# Altium schematic sheet ST_Board.SchDoc
size A4; SheetNumber: 1; SheetTotal: 1
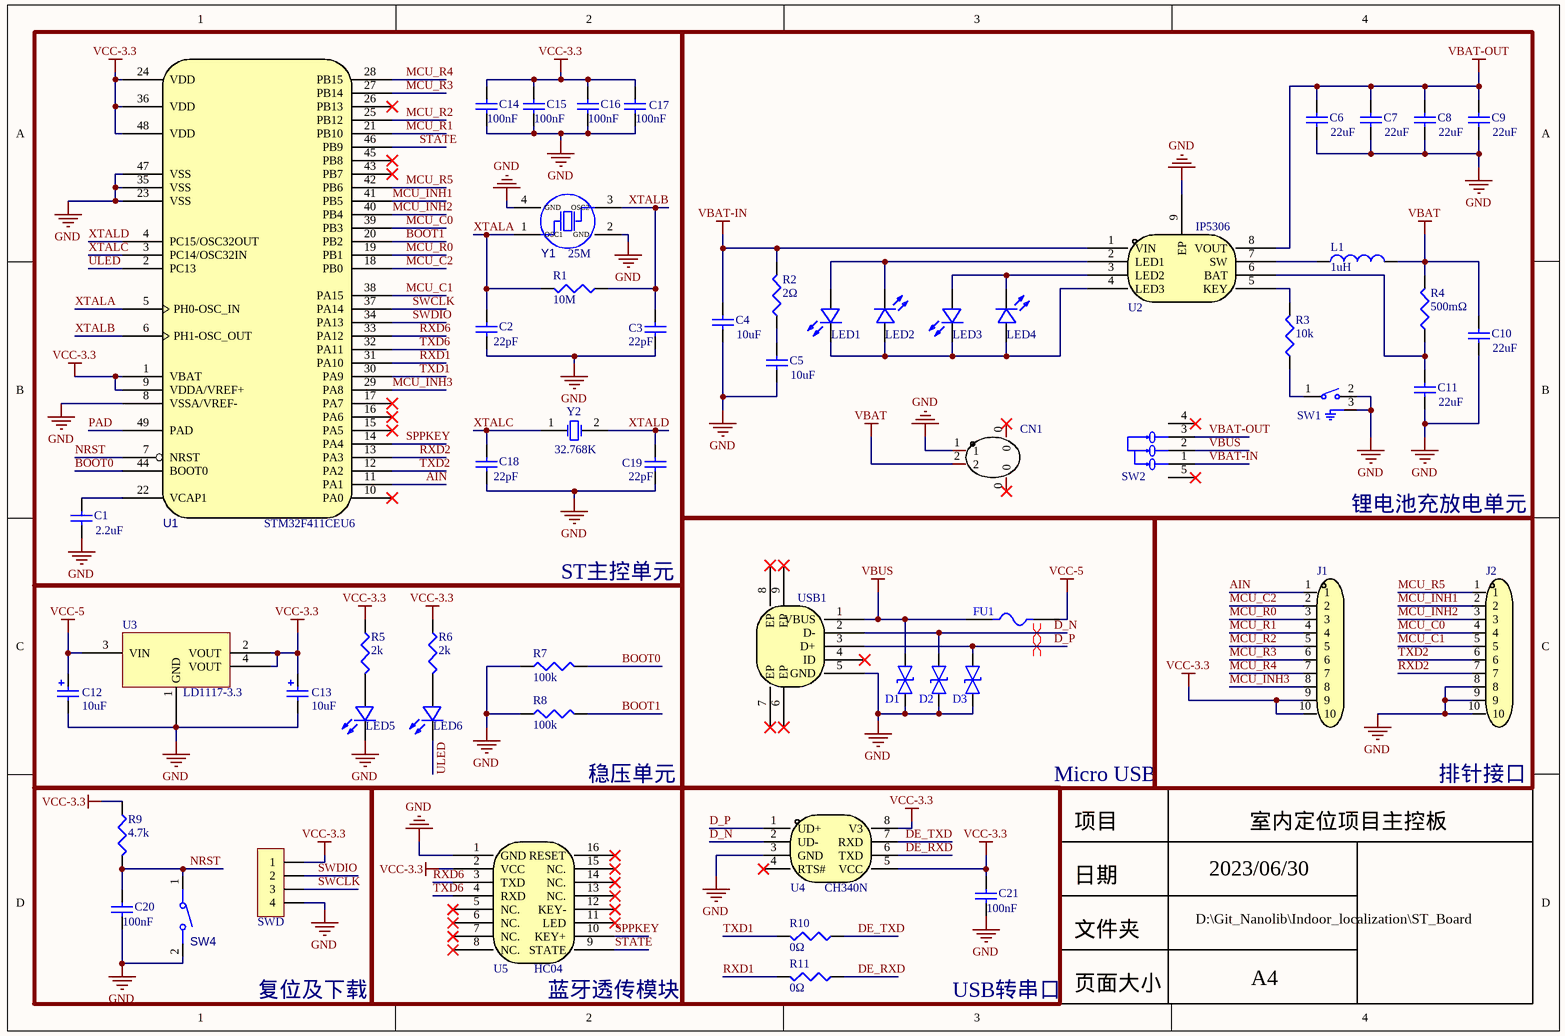
[diagram p0: ST_Board.SchDoc]

## Parts
C1  value 2.2uF  [C0603]  (hidden comment: Cap)
C2  value 22pF  [C0603]  (hidden comment: Cap)
C3  value 22pF  [C0603]  (hidden comment: Cap)
C4  value 10uF  [C0603]  (hidden comment: Cap)
C5  value 10uF  [C0603]  (hidden comment: Cap)
C6  value 22uF  [C1206]  (hidden comment: Cap)
C7  value 22uF  [C1206]  (hidden comment: Cap)
C8  value 22uF  [C1206]  (hidden comment: Cap)
C9  value 22uF  [C1206]  (hidden comment: Cap)
C10  value 22uF  [C1206]  (hidden comment: Cap)
C11  value 22uF  [C1206]  (hidden comment: Cap)
C12  value 10uF  [CAP-SMD_L3.2-W1.6-RD-C7171]  (hidden comment: TAJA106K016RNJ)
C13  value 10uF  [CAP-SMD_L3.2-W1.6-RD-C7171]  (hidden comment: TAJA106K016RNJ)
C14  value 100nF  [C0603]  (hidden comment: Cap)
C15  value 100nF  [C0603]  (hidden comment: Cap)
C16  value 100nF  [C0603]  (hidden comment: Cap)
C17  value 100nF  [C0603]  (hidden comment: Cap)
C18  value 22pF  [C0603]  (hidden comment: Cap)
C19  value 22pF  [C0603]  (hidden comment: Cap)
C20  value 100nF  [C0603]  (hidden comment: Cap)
C21  value 100nF  [C0603]  (hidden comment: Cap)
CN1  1.0T-2P卧贴  [CONN-SMD_1.0T-2P]  (value not drawn)
D1  LESD5D5.0CT1G  [SOD-523_L1.2-W0.8-LS1.6-BI]  (value not drawn)
D2  LESD5D5.0CT1G  [SOD-523_L1.2-W0.8-LS1.6-BI]  (value not drawn)
D3  LESD5D5.0CT1G  [SOD-523_L1.2-W0.8-LS1.6-BI]  (value not drawn)
FU1  FUSE 1A  [F0805]  (value not drawn)
J1  Header 10X1  [HDR-TH_10P-P2.54-V-M]  (value not drawn)
J2  Header 10X1  [HDR-TH_10P-P2.54-V-M]  (value not drawn)
L1  value 1uH  [IND-SMD_L6.5-W6.5_IHLP-2525]  (hidden comment: Inductor)
LED1  NCD0603G2  [LED0603-RD]  (value not drawn)
LED2  NCD0603G2  [LED0603-RD]  (value not drawn)
LED3  NCD0603G2  [LED0603-RD]  (value not drawn)
LED4  NCD0603G2  [LED0603-RD]  (value not drawn)
LED5  NCD0603G2  [LED0603-RD]  (value not drawn)
LED6  NCD0603G2  [LED0603-RD]  (value not drawn)
R1  10M  [R0603]
R2  2Ω  [R0603]
R3  10k  [R0603]
R4  500mΩ  [R0603]
R5  2k  [R0603]
R6  2k  [R0603]
R7  100k  [R0603]
R8  100k  [R0603]
R9  4.7k  [R0603]
R10  0Ω  [R0603]
R11  0Ω  [R0603]
SW1  GT-TCB73B-H048-L1  [SW-TH_G-SWITCH_GT-TCB73B-H048-L1]  (value not drawn)
SW2  SK12D07VG3  [SW-TH_SK12D07VG3]  (value not drawn)
SW4  TS-1088-AR02016  [SW-SMD_L3.9-W3.0-P4.45]  (value not drawn)
SWD  SWD  [HDR-TH_4P-P2.54-V-F]  (value not drawn)
U1  STM32F411CEU6  [UFQFPN-48_L7.0-W7.0-P0.50-BL-EP]
U2  IP5306  [ESOP-8_L4.9-W3.9-P1.27-LS6.0-BL-EP]
U3  LD1117-3.3  [SOT-223-3_L6.5-W3.4-P2.30-LS7.0-BR]
U4  CH340N  [SOP-8_L4.9-W3.9-P1.27-LS6.0-BL]
U5  HC04  [HC-04]
USB1  U-F-M5DD-W-2  [MICRO-USB-SMD_MICRO-USB-A17]  (value not drawn)
Y1  25M  [OSC-SMD_4P-L3.2-W2.5-BL]
Y2  32.768K  [FC-135R_L3.2-W1.5]

## Blocks framed on the sheet
ST主控单元: C1-C3 C14-C19 R1 U1 Y1 Y2
锂电池充放电单元: C4-C11 CN1 L1 LED1-LED4 R2-R4 SW1 SW2 U2
Micro USB: D1-D3 FU1 USB1
复位及下载: C20 R9 SW4 SWD

## Nets
GND: C1.1 C2.1 C3.1 C4.1 C5.1 C6.1 C7.1 C8.1 C9.1 C10.1 C11.1 C12.2 C13.2 C14.1 C15.1 C16.1 C17.1 C18.1 C19.1 C20.1 C21.1 CN1.1 D1.1 D2.1 D3.1 J2.8 J2.9 J2.10 LED5.1(K) R7.1 R8.1 SW1.2 SW1.3 SW4.2 SWD.4 U1.8(VSSA/VREF-) U1.23(VSS) U1.35(VSS) U1.47(VSS) U2.9(EP) U3.1(GND) U4.3(GND) U5.1(GND) USB1.5(GND) Y1.2(GND) Y1.4(GND)
VBAT: C10.2 CN1.2 L1.2 R4.2
VBAT-IN: C4.2 R2.2 SW2.1 U2.1(VIN)
VBAT-OUT: C6.2 C7.2 C8.2 C9.2 SW2.3 U2.8(VOUT)
VBUS: D1.2 FU1.1 SW2.2 USB1.1(VBUS)
VCC-3.3: C13.1 C14.2 C15.2 C16.2 C17.2 C21.2 J1.9 J1.10 R5.1 R6.1 R9.1 SWD.1 U1.1(VBAT) U1.9(VDDA/VREF+) U1.24(VDD) U1.36(VDD) U1.48(VDD) U3.2(VOUT) U3.4(VOUT) U4.5(VCC) U4.8(V3) U5.2(VCC)
VCC-5: C12.1 FU1.2 U3.3(VIN)
AIN: J1.1 U1.11(PA1)
BOOT0: R7.2 U1.44(BOOT0)
BOOT1: R8.2 U1.20(PB2)
D_N: D2.2 U4.2(UD-) USB1.2(D-)
D_P: D3.2 U4.1(UD+) USB1.3(D+)
DE_RXD: R11.1 U4.6(TXD)
DE_TXD: R10.1 U4.7(RXD)
MCU_C0: J2.4 U1.39(PB3)
MCU_C1: J2.5 U1.38(PA15)
MCU_C2: J1.2 U1.18(PB0)
MCU_INH1: J2.2 U1.41(PB5)
MCU_INH2: J2.3 U1.40(PB4)
MCU_INH3: J1.8 U1.29(PA8)
MCU_R0: J1.3 U1.19(PB1)
MCU_R1: J1.4 U1.21(PB10)
MCU_R2: J1.5 U1.25(PB12)
MCU_R3: J1.6 U1.27(PB14)
MCU_R4: J1.7 U1.28(PB15)
MCU_R5: J2.1 U1.42(PB6)
NRST: C20.2 R9.2 SW4.1 U1.7(NRST)
PAD: U1.49(PAD)
RXD1: R11.2 U1.31(PA10)
RXD2: J2.7 U1.13(PA3)
RXD6: U1.33(PA12) U5.3(TXD)
SPPKEY: U1.14(PA4) U5.10(KEY+)
STATE: U1.46(PB9) U5.9(STATE)
SWCLK: SWD.3 U1.37(PA14)
SWDIO: SWD.2 U1.34(PA13)
TXD1: R10.2 U1.30(PA9)
TXD2: J2.6 U1.12(PA2)
TXD6: U1.32(PA11) U5.4(RXD)
ULED: LED6.1(K) U1.2(PC13)
XTALA: C2.2 R1.2 U1.5(PH0-OSC_IN) Y1.1(OSC1)
XTALB: C3.2 R1.1 U1.6(PH1-OSC_OUT) Y1.3(OSC2)
XTALC: C18.2 U1.3(PC14/OSC32IN) Y2.1(OSC1)
XTALD: C19.2 U1.4(PC15/OSC32OUT) Y2.2(OSC2)
NetC1_2: C1.2 U1.22(VCAP1)
NetC5_2: C5.2 R2.1
NetC11_2: C11.2 R4.1 U2.6(BAT)
NetL1_1: L1.1 U2.7(SW)
NetLED1_1: LED1.1(K) LED2.2(A) LED3.1(K) LED4.2(A) U2.4(LED3)
NetLED1_2: LED1.2(A) LED2.1(K) U2.2(LED1)
NetLED3_2: LED3.2(A) LED4.1(K) U2.3(LED2)
NetLED5_2: LED5.2(A) R5.2
NetLED6_2: LED6.2(A) R6.2
NetR3_1: R3.1 SW1.1
NetR3_2: R3.2 U2.5(KEY)

Not connected (* = marked no-connect by the designer): CN1 0*; SW2 4* 5*; U1 10(PA0)* 15(PA5)* 16(PA6)* 17(PA7)* 26(PB13)* 43(PB7)* 45(PB8)*; U4 4(RTS#)*; U5 5(NC.)* 6(NC.)* 7(NC.)* 8(NC.)* 11(LED)* 12(KEY-)* 13(NC.)* 14(NC.)* 15(NC.)* 16(RESET)*; USB1 4(ID)* 6(EP)* 7(EP)* 8(EP)* 9(EP)*

## Layout directives
differential pair: D_N, D_P

## Notes on the sheet
- 稳压单元
- (near J2) 排针接口
- 项目
- 室内定位项目主控板
- 日期
- 2023/06/30
- 文件夹
- D:\Git_Nanolib\Indoor_localization\ST_Board
- A4
- (near U5) 蓝牙透传模块
- USB转串口
- 页面大小

## Library data of the parts
C1-C11 C14-C21 = Cap: Capacitor; Published: 8-Jun-2000; LatestRevisionDate: 17-Jul-2002; LatestRevisionNote: Re-released for DXP Platform.; PackageReference: RAD-0.3; Publisher: Altium Limited; PackageDescription: Radial Cap, Thru-Hole; 2 Leads; 0.3 in Pin Spacing
C12 C13 = Cap-TAJA: 贴片钽电容; Manufacturer: Kyocera AVX; Add into BOM: yes; Tolerance: ±10%; Rated Voltage: 16V; Equivalent Series Resistance(ESR): 3Ω@100kHz; Name: 10uF; Symbol: TAJA106K016RNJ; Device: TAJA106K016RNJ; LCSC Part Name: 10uF ±10% 16V; Supplier Part: C7171; Manufacturer Part: TAJA106K016RNJ; Supplier Footprint: CASE-A-3216; JLCPCB Part Class: Basic Part; Datasheet: https://atta.szlcsc.com/upload/public/pdf/source/20160107/1457707748093.pdf; Supplier: LCSC; Convert to PCB: yes; Operating Temperature: -55℃~+125℃
CN1 = 1.0T-2P卧贴: 锂电池接口; Manufacturer: BOOMELE(博穆精密); Symbol: 1.0T-2P_C145954; Add into BOM: yes; Reference Series: SH; Pitch: 1mm; Pins Structure: 1x2P; Number of PINs Per Row: 2; Name: 1.0T-2P卧贴; Device: 1.0T-2P卧贴; LCSC Part Name: SH 1mm 1x2P 卧贴; Supplier Part: C145954; Manufacturer Part: 1.0T-2P卧贴; Supplier Footprint: SMD,P=1mm; JLCPCB Part Class: Extended Part; Datasheet: https://atta.szlcsc.com/upload/public/pdf/source/20171115/C145954_15107293403501120439.pdf; Supplier: LCSC; Convert to PCB: yes; Number of Rows: 1; Row Spacing: -; Mounting Style: -; Contact Material: 磷铜
D1-D3 = LESD5D5.0CT1G: 静电放电(ESD)保护器件; Designer: U?; Symbol: LESD5D5.0CT1G; Device: LESD5D5.0CT1G
FU1 = FU: 贴片保险丝; Manufacturer: RUILON(瑞隆源); Name: SMD0805P075TF; Device: SMD0805P075TF_C20979; Add into BOM: yes; Operating Voltage (Max): 6V; Current Rating (Max): 40A; Hold Current: 750mA; Trip Current: 1.5A; Symbol: SMD0805P075TF; LCSC Part Name: 6V 750mA 0805自恢复; Supplier Part: C20979; Manufacturer Part: SMD0805P075TF; Supplier Footprint: 0805; JLCPCB Part Class: Extended Part; Datasheet: https://atta.szlcsc.com/upload/public/pdf/source/20140222/1457706788789.pdf; Supplier: LCSC; Convert to PCB: yes
J1 J2 = Header 10X1: 10P*1接插件; Symbol: MF254V-11-10-1000-H70; Designer: U?; Device: MF254V-11-10-1000-H70
L1 = Inductor: Code_IEC: 1005; Published: 8-Jun-2000; LatestRevisionDate: 29-May-2009; LatestRevisionNote: IPC-7351 Footprint Added.; PackageReference: 0402-A; Publisher: Altium Limited; PackageDescription: Chip Inductor; Code_JEITA: 0402
LED1-LED4 = NCD0603G2: Manufacturer: 国星光电; Symbol: FC-1608UGK-520D; Add into BOM: yes; Emitted Color: 翠绿; Name: NCD0603G2; Device: NCD0603G2; LCSC Part Name: 翠绿; Supplier Part: C87326; Manufacturer Part: NCD0603G2; Supplier Footprint: 0603; JLCPCB Part Class: Extended Part; Datasheet: https://atta.szlcsc.com/upload/public/pdf/source/20200820/C87326_434E337B13CFAB9A1423E0838CFDDDAC.pdf; Supplier: LCSC; Convert to PCB: yes
LED5 LED6 = NCD0603G2: LED; Manufacturer: 国星光电; Symbol: FC-1608UGK-520D; Add into BOM: yes; Emitted Color: 翠绿; Name: NCD0603G2; Device: NCD0603G2; LCSC Part Name: 翠绿; Supplier Part: C87326; Manufacturer Part: NCD0603G2; Supplier Footprint: 0603; JLCPCB Part Class: Extended Part; Datasheet: https://atta.szlcsc.com/upload/public/pdf/source/20200820/C87326_434E337B13CFAB9A1423E0838CFDDDAC.pdf; Supplier: LCSC; Convert to PCB: yes
R1-R11 = Res3: Resistor; Published: 8-Jun-2000; LatestRevisionDate: 29-May-2009; LatestRevisionNote: IPC-7351 Footprint Added.; PackageReference: J1-0603; Publisher: Altium Limited; PackageDescription: Chip Resistor
SW1 = GT-TCB73B-H048-L1: Manufacturer: G-Switch(品赞); Add into BOM: yes; Contact Current: 50mA; Voltage Rating (DC): 12V; Insulation Resistance: 100MΩ; Circuit: 单刀单掷; Actuator Style: 圆形按钮; Actuator/Cap Color: 黑色; With Lamp: 无; Operating Force: 250gf@±30gf; Mechanical Life: 10万次; Pin Style: PC引脚; Switch Length: 4.5mm; Switch Height: 4.8mm; Strike Gundam: 否; Name: GT-TCB73B-H048-L1; Symbol: GT-TCB73B-H048-L1; Device: GT-TCB73B-H048-L1; LCSC Part Name: 4.5*4.5*4.8mm 卧插 轻触开关; Supplier Part: C2890354; Manufacturer Part: GT-TCB73B-H048-L1; Supplier Footprint: 插件; JLCPCB Part Class: Extended Part; Datasheet: https://atta.szlcsc.com/upload/public/pdf/source/20211129/A9DBC36F7854845B7C58D6A3B2089FE3.pdf; Supplier: LCSC; Convert to PCB: yes; Mounting Style: 卧插; Operating Temperature: -30℃~+85℃; Switch Width: 4.5mm
SW2 = SK12D07VG3: Manufacturer: SHOU HAN(首韩); Symbol: SK12D07VG3_C431547; Add into BOM: yes; Name: SK12D07VG3; Device: SK12D07VG3; LCSC Part Name: 两档位卧式拨动开关,柄长3MM; Supplier Part: C431547; Manufacturer Part: SK12D07VG3; Supplier Footprint: 插件; JLCPCB Part Class: Extended Part; Datasheet: https://atta.szlcsc.com/upload/public/pdf/source/20190925/C431547_01B93C6F3FA5C09E15F8CCBF4E6DB91A.pdf; Supplier: LCSC; Convert to PCB: yes
SW4 = TS-1088-AR02016: Manufacturer: XUNPU(讯普); Add into BOM: yes; Contact Current: 50mA; Voltage Rating (DC): 12V; Insulation Resistance: 100MΩ; Circuit: 单刀单掷; Actuator Style: 圆形按钮; Actuator/Cap Color: 黑色; Operating Force: 160gf@±50gf; Mechanical Life: 10万次; Pin Style: SMD接片; Switch Length: 4mm; Switch Width: 3mm; Switch Height: 2mm; Strike Gundam: 否; Name: TS-1088-AR02016; Symbol: TS-1088-AR02016; Device: TS-1088-AR02016; LCSC Part Name: 4*3*2mm 立贴 轻触开关; Supplier Part: C720477; Manufacturer Part: TS-1088-AR02016; Supplier Footprint: SMD; JLCPCB Part Class: Extended Part; Datasheet: https://atta.szlcsc.com/upload/public/pdf/source/20200810/C720475_60D09DD6C54279ADDB2DC25100F1CC11.pdf; Supplier: LCSC; Convert to PCB: yes; Mounting Style: 立贴; Operating Temperature: -30℃~+80℃
SWD = Header 4: 4P接插件; 版权归属: 源创客; BOM名称: 4P接插件; 学习资源: www.ooocke.com
U1 = STM32F411CEU6: Designer: U?; Symbol: STM32F411CEU6; Device: STM32F411CEU6
U2 = IP5306: Manufacturer: INJOINIC(英集芯); Add into BOM: yes; Name: IP5306; Symbol: IP5306; Device: IP5306; LCSC Part Name: IP5306; Supplier Part: C181692; Manufacturer Part: IP5306; Supplier Footprint: ESOP-8; JLCPCB Part Class: Extended Part; Datasheet: https://atta.szlcsc.com/upload/public/pdf/source/20180920/C181692_842C9BF636DF123BB66E91FC1AD6F13F.pdf; Supplier: LCSC; Convert to PCB: yes
U3 = LD1117-3.3: 低压差线性稳压器3.3V
U4 = CH340N: Symbol: CH340N_C2977777; Designer: U?; Device: CH340N_C2977777
U5 = HC04: SPP2.1+BLE5.0
USB1 = U-F-M5DD-W-2: Manufacturer: 韩国韩荣; Add into BOM: yes; Connector Type: Micro-B; Gender: 母座; Number of Contacts: 5; Number of Ports: 1; Name: U-F-M5DD-W-2; Symbol: U-F-M5DD-W-2; Device: U-F-M5DD-W-2; LCSC Part Name: U-F-M5DD-W-2; Supplier Part: C145793; Manufacturer Part: U-F-M5DD-W-2; Supplier Footprint: -; JLCPCB Part Class: Extended Part; Datasheet: https://atta.szlcsc.com/upload/public/pdf/source/20200930/C879723_6542CD70930DA81B6877F7A914B29468.pdf; Supplier: LCSC; Convert to PCB: yes; Standard: USB 2
Y1 = XTAL 4pin: Manufacturer: TKD(泰晶); Symbol: SX32Y025000BA1T; Add into BOM: yes; Name: -; Device: SX32Y025000BA1T; LCSC Part Name: 3225 25M 10PF  10ppm  -20 -75℃; Supplier Part: C271631; Manufacturer Part: SX32Y025000BA1T; Supplier Footprint: SMD3225-4P; JLCPCB Part Class: Extended Part; Datasheet: https://atta.szlcsc.com/upload/public/pdf/source/20180829/C271631_9AC1C7FBF3C0341070E3D84891BB0616.pdf; Supplier: LCSC; Convert to PCB: yes; Crystal Type: -; Value: -; Load Capacitance: -; Operating Temperature: -
Y2 = XTAL: 晶振; Published: 8-Jun-2000; LatestRevisionDate: 17-Jul-2002; LatestRevisionNote: Re-released for DXP Platform.; PackageReference: R38; Publisher: Altium Limited; PackageDescription: Crystal, Thru-Hole; 2 Leads; Body 3.1 x 8.2 mm (Dia.xH)